# EasyEDA schematic SCH_智能鱼缸_2023-12-28.json
TITLE: Sheet_1; REV: 1.0; Date: 2023-05-17; Sheet: 1/1; Drawn By: CQT-LINFENG; Company: Your Company
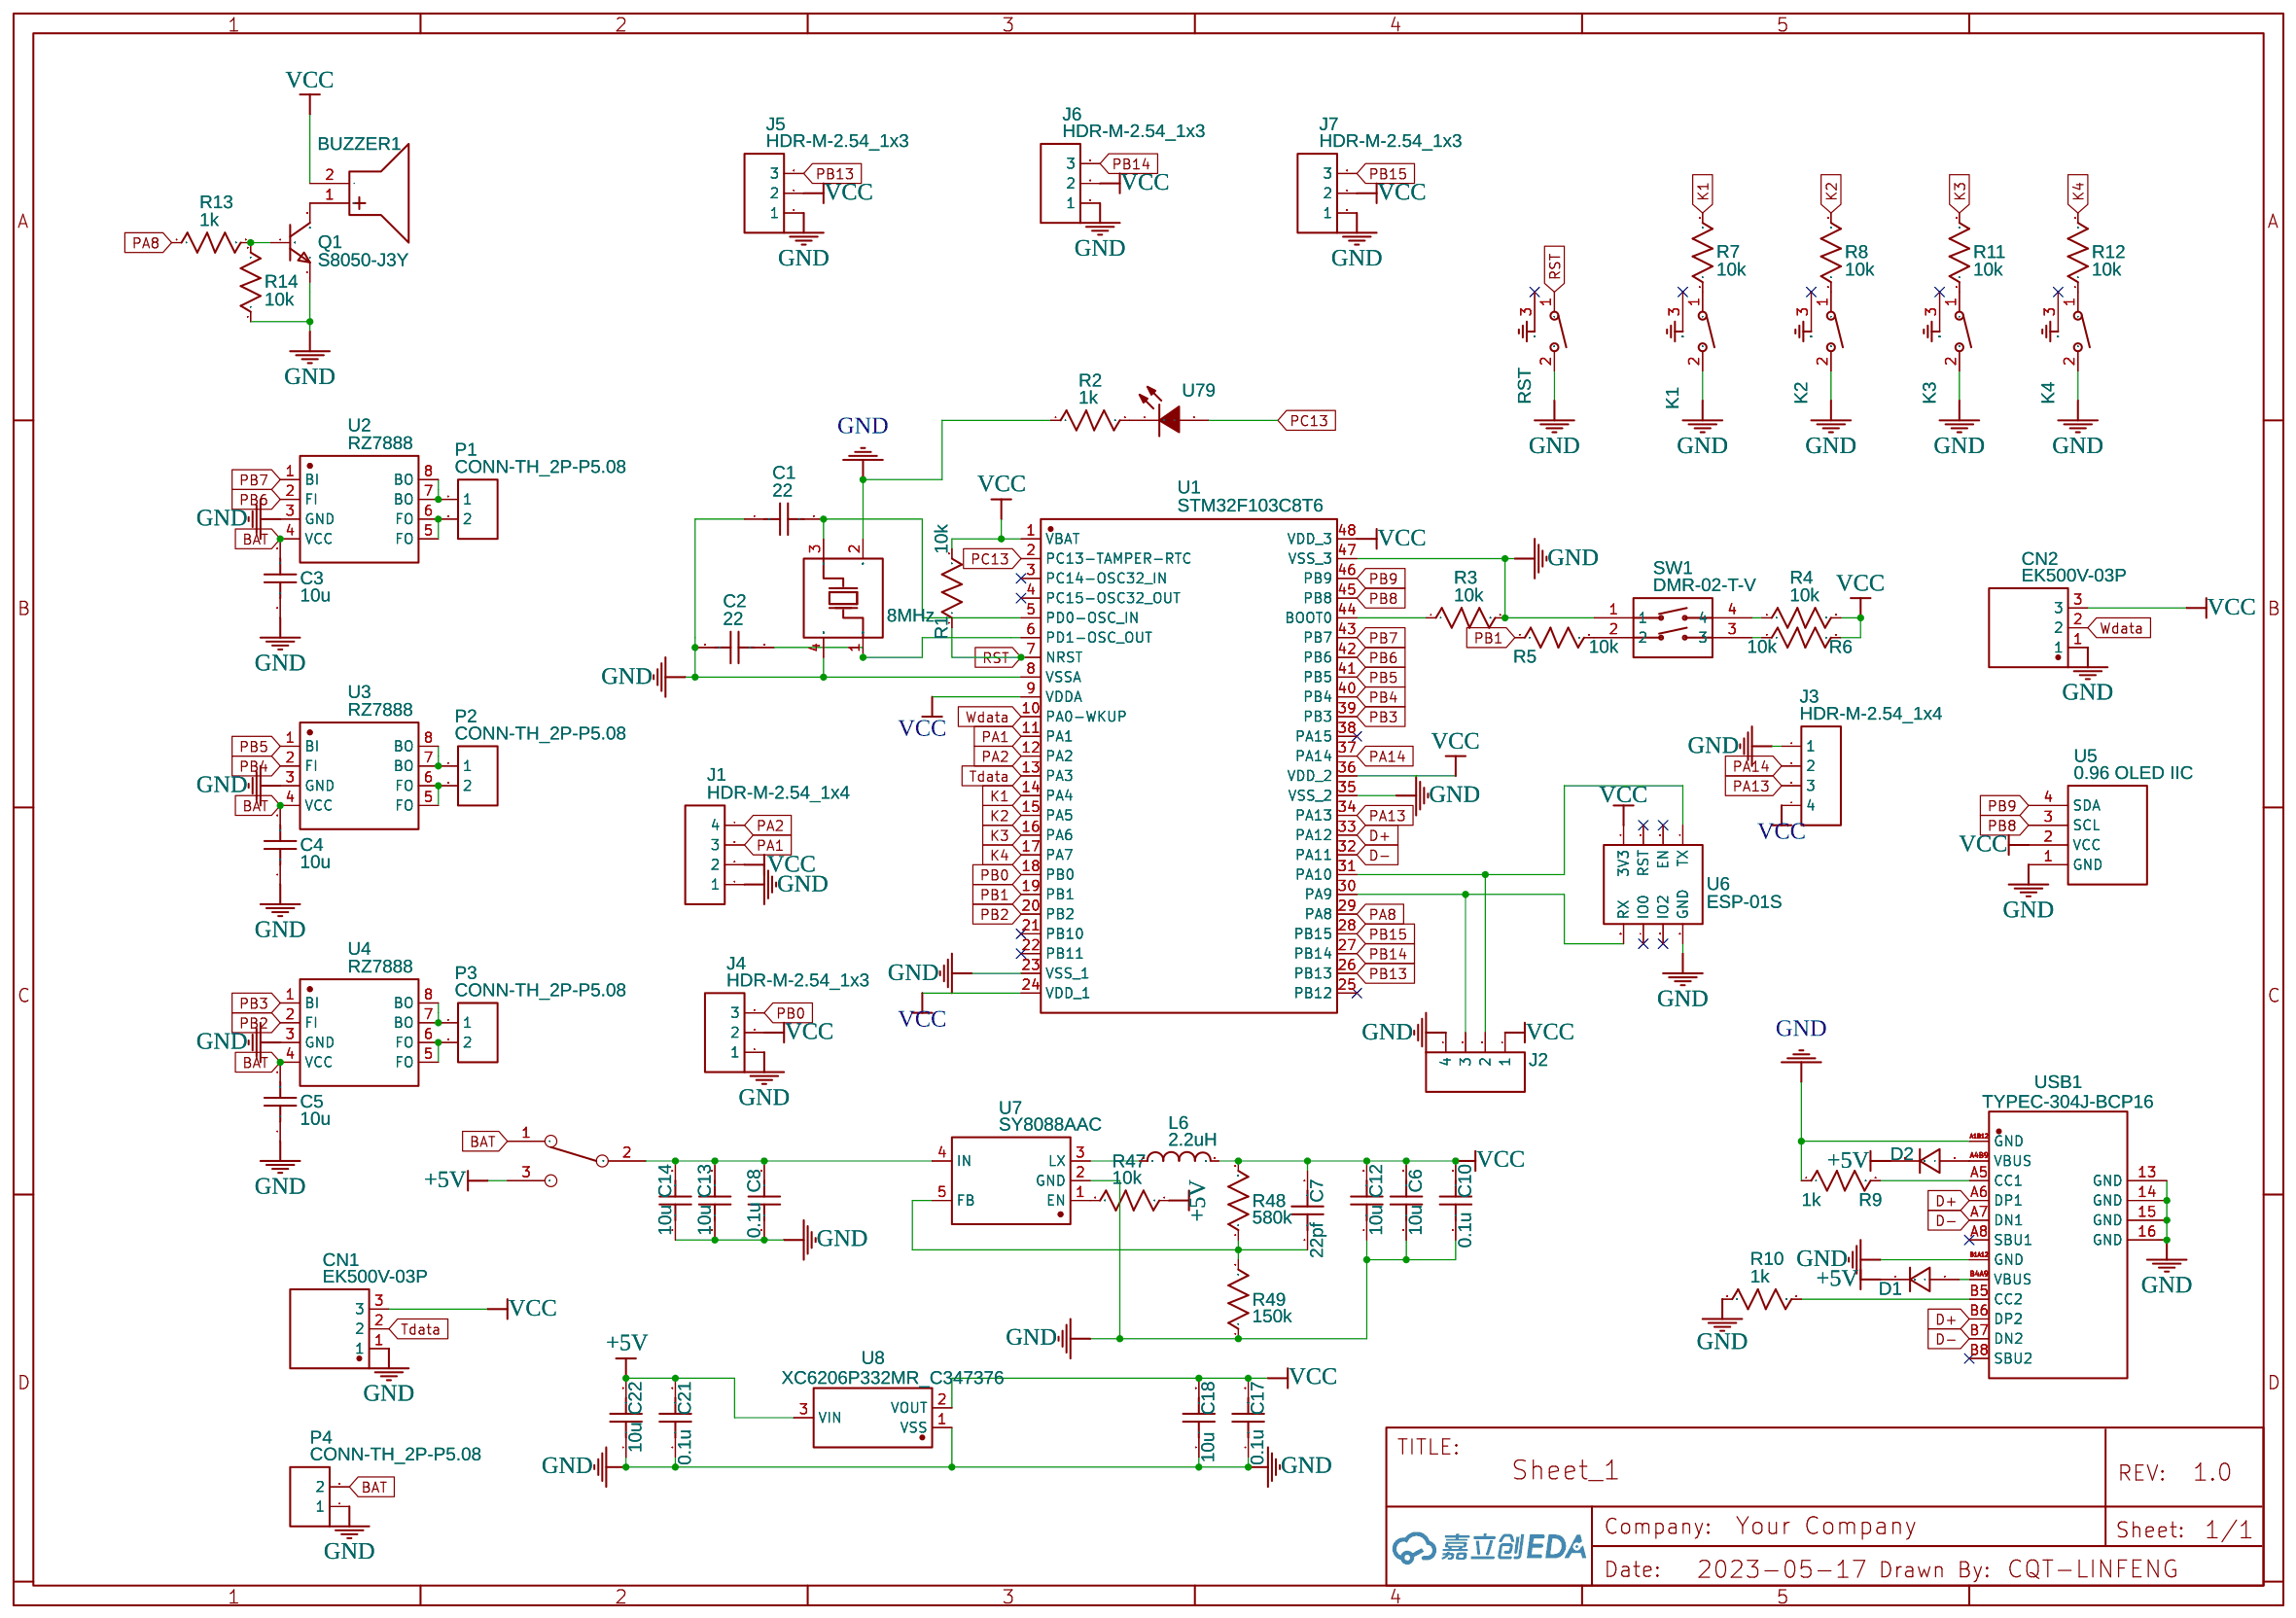
[diagram p0: schematic sheet]

## Parts
BUZZER1  有源蜂鸣器直径9*5.5MM3V  [BUZ-TH_BD9.0-P5.00-D0.6-L-FD]
C1  22  [C0402]
C2  22  [C0402]
C3  10u  [C0402]
C4  10u  [C0402]
C5  10u  [C0402]
C6  10u  [C0402]
C7  22pf  [C0402]
C8  0.1u  [C0402]
C10  0.1u  [C0402]
C12  10u  [C0402]
C13  10u  [C0402]
C14  10u  [C0402]
C17  0.1u  [C0402]
C18  10u  [C0402]
C21  0.1u  [C0402]
C22  10u  [C0402]
CN1  EK500V-03P  [CONN-TH_EK500V-03P]
CN2  EK500V-03P  [CONN-TH_EK500V-03P]
D1  1N4148WSG  [SOD-323_L1.8-W1.3-LS2.5-RD]
D2  1N4148WSG  [SOD-323_L1.8-W1.3-LS2.5-RD]
ENABLE1  SS-12D00-G4  [SS-12D00-G4]
J1  HDR-M-2.54_1x4  [HDR-M-2.54_1X4]
J2  HDR-M-2.54_1x4  [HDR-M-2.54_1X4]
J3  HDR-M-2.54_1x4  [HDR-M-2.54_1X4]
J4  HDR-M-2.54_1x3  [HDR-M-2.54_1X3]
J5  HDR-M-2.54_1x3  [HDR-M-2.54_1X3]
J6  HDR-M-2.54_1x3  [HDR-M-2.54_1X3]
J7  HDR-M-2.54_1x3  [HDR-M-2.54_1X3]
K1  侧按键  [侧按键]
K2  侧按键  [侧按键]
K3  侧按键  [侧按键]
K4  侧按键  [侧按键]
L6  2.2uH  [IND-SMD_L3.5-W3.0]
P1  CONN-TH_2P-P5.08  [CONN-TH_2P-P5.08]
P2  CONN-TH_2P-P5.08  [CONN-TH_2P-P5.08]
P3  CONN-TH_2P-P5.08  [CONN-TH_2P-P5.08]
P4  CONN-TH_2P-P5.08  [CONN-TH_2P-P5.08]
Q1  S8050-J3Y  [SOT-23-3_L3.0-W1.7-P0.95-LS2.9-BR]
R1  10k  [R0402]
R2  1k  [R0402]
R3  10k  [R0402]
R4  10k  [R0402]
R5  10k  [R0402]
R6  10k  [R0402]
R7  10k  [R0402]
R8  10k  [R0402]
R9  1k  [R0402]
R10  1k  [R0402]
R11  10k  [R0402]
R12  10k  [R0402]
R13  1k  [R0402]
R14  10k  [R0402]
R47  10k  [R0402]
R48  580k  [R0402]
R49  150k  [R0402]
RST  侧按键  [侧按键]
SW1  DMR-02-T-V  [SW-SMD_DMR-02-T-V]
U1  STM32F103C8T6  [LQFP-48_L7.0-W7.0-P0.50-LS9.0-BL]
U2  RZ7888  [SOP-8_L4.9-W3.9-P1.27-LS6.0-BL]
U3  RZ7888  [SOP-8_L4.9-W3.9-P1.27-LS6.0-BL]
U4  RZ7888  [SOP-8_L4.9-W3.9-P1.27-LS6.0-BL]
U5  0.96 OLED IIC  [OLED-TH_OLED0.96-IIC]
U6  ESP-01S  [ESP01S-(ESP01)]
U7  SY8088AAC  [SOT-23-5_L3.0-W1.7-P0.95-LS2.8-BR]
U8  XC6206P332MR_C347376  [SOT-23-3_L3.0-W1.7-P0.95-LS2.9-BR]
U79  GBG-C281TBKT  [LED0402-RD]
USB1  TYPEC-304J-BCP16  [USB-C-SMD_TYPEC-304J-BCP16]
X1  8MHz  [CRYSTAL-SMD_4P-L3.2-W2.5-BL]

## Library data of the parts
BUZZER1 = 有源蜂鸣器直径9*5.5MM3V: Supplier: LCSC; Supplier Part: C9900012728; Manufacturer: null; Manufacturer Part: 有源蜂鸣器直径9*5.5mm3V; Contributor: LCSC; JLCPCB Part Class: Extended Part
C1-C8 C10 C12-C14 C17 C18 C21 C22 = C_0402_US: Contributor: LCEDA_Lib
CN1 CN2 = EK500V-03P: Supplier: LCSC; Supplier Part: C182803; Manufacturer: dinkle(町洋); Contributor: LCSC; JLCPCB Part Class: Extended Part
D1 D2 = 1N4148WSG: Supplier: LCSC; Supplier Part: C380926; Manufacturer: 银河微电子; Contributor: LCSC; JLCPCB Part Class: Extended Part
ENABLE1 = SS-12D00-G4: Contributor: 1898stark
J1-J3 = HDR-M-2.54_1x4: Supplier Part: C124378; Supplier: LCSC; Contributor: LCEDA_Lib
J4-J7 = HDR-M-2.54_1x3: Supplier Part: C180248; Supplier: LCSC; Contributor: LCEDA_Lib
K1-K4 RST = 侧按键: Contributor: liyichuangeda
L6 = SMTDR32-2R2M: Supplier: LCSC; Supplier Part: C326182; Manufacturer: 3L COILS; Contributor: LCSC
P1-P4 = CONN-TH_2P-P5.08: Supplier: LCSC; Contributor: LCEDA_Lib
Q1 = S8050-J3Y: Supplier: LCSC; Supplier Part: C364312; Manufacturer: MDD; Contributor: LCSC; JLCPCB Part Class: Extended Part
R1-R14 R47-R49 = R_0402_US: Contributor: LCEDA_Lib
SW1 = DMR-02-T-V: Supplier: LCSC; Manufacturer: 圜达; Contributor: LCSC; Supplier Part: C139554; JLCPCB Part Class: Extended Part
U1 = STM32F103C8T6: Supplier: LCSC; Manufacturer: ST(意法半导体); Supplier Part: C8734; JLCPCB Part Class: Basic Part
U2-U4 = RZ7888: Supplier: LCSC; Manufacturer: RZ; Supplier Part: C94177; JLCPCB Part Class: Extended Part
U5 = 0.96 OLED IIC: Contributor: 0errors0warning
U6 = ESP-01S: Supplier: Add New Supplier; Contributor: zhangshiyu
U7 = SY8088AAC: Supplier: LCSC; Manufacturer: Silergy; Supplier Part: C79313; LCSC Assembly: Yes; SMT Type: Extend; Contributor: Sanksu
U8 = XC6206P332MR_C347376: Supplier: LCSC; Supplier Part: C347376; Manufacturer: UMW(广东友台半导体); Manufacturer Part: XC6206P332MR; Contributor: LCSC; JLCPCB Part Class: Extended Part
U79 = GBG-C281TBKT: Supplier: LCSC; Supplier Part: C2892152; Manufacturer: GBG; link: https://atta.szlcsc.comnull; Contributor: lcsc
USB1 = TYPEC-304J-BCP16: Supplier: LCSC; Supplier Part: C2835315; Manufacturer: XUNPU(讯普); Contributor: LCSC; JLCPCB Part Class: Extended Part
X1 = X1E0000210375000G: Supplier: LCSC; Manufacturer: EPSON(爱普生); Manufacturer Part: X1E000021037500; Contributor: LCSC; Supplier Part: C89379; JLCPCB Part Class: Extended Part

## Nets
+5V: C21.2 C22.2 D1.1(C) D2.1(C) ENABLE1.3 R47.1 U8.3(VIN)
GND: C1.1 C2.1 C3.1 C4.1 C5.1 C6.1 C8.1 C10.1 C12.1 C13.1 C14.1 C17.1 C18.1 C21.1 C22.1 CN1.1 CN2.1 J1.1 J2.4 J3.1 J4.1 J5.1 J6.1 J7.1 K1.2 K2.2 K3.2 K4.2 P4.1 Q1.2(E) R2.1 R3.2 R9.1 R10.1 R14.1 R49.1 RST.2 SW1.1 U1.8(VSSA) U1.23(VSS_1) U1.35(VSS_2) U1.47(VSS_3) U2.3(GND) U3.3(GND) U4.3(GND) U5.1(GND) U6.5(GND) U7.2(GND) U8.1(VSS) USB1.13(GND) USB1.14(GND) USB1.15(GND) USB1.16(GND) USB1.A1B12(GND) USB1.B1A12(GND) X1.2(GND) X1.4(GND)
VCC: BUZZER1.2(-) C6.2 C7.2 C10.2 C12.2 C17.2 C18.2 CN1.3 CN2.3 J1.2 J2.1 J3.4 J4.2 J5.2 J6.2 J7.2 L6.2 R1.2 R4.2 R6.2 R48.2 U1.1(VBAT) U1.9(VDDA) U1.24(VDD_1) U1.36(VDD_2) U1.48(VDD_3) U5.2(VCC) U6.1(3V3) U8.2(VOUT)
BAT: C3.2 C4.2 C5.2 ENABLE1.1 P4.2 U2.4(VCC) U3.4(VCC) U4.4(VCC)
D+: U1.33(PA12) USB1.A6(DP1) USB1.B6(DP2)
D-: U1.32(PA11) USB1.A7(DN1) USB1.B7(DN2)
K1: R7.2 U1.14(PA4)
K2: R8.2 U1.15(PA5)
K3: R11.2 U1.16(PA6)
K4: R12.2 U1.17(PA7)
PA1: J1.3 U1.11(PA1)
PA2: J1.4 U1.12(PA2)
PA8: R13.1 U1.29(PA8)
PA13: J3.3 U1.34(PA13)
PA14: J3.2 U1.37(PA14)
PB0: J4.3 U1.18(PB0)
PB1: R5.1 U1.19(PB1)
PB2: U1.20(PB2) U4.2(FI)
PB3: U1.39(PB3) U4.1(BI)
PB4: U1.40(PB4) U3.2(FI)
PB5: U1.41(PB5) U3.1(BI)
PB6: U1.42(PB6) U2.2(FI)
PB7: U1.43(PB7) U2.1(BI)
PB8: U1.45(PB8) U5.3(SCL)
PB9: U1.46(PB9) U5.4(SDA)
PB13: J5.3 U1.26(PB13)
PB14: J6.3 U1.27(PB14)
PB15: J7.3 U1.28(PB15)
PC13: U1.2(PC13-TAMPER-RTC) U79.2(A)
RST: R1.1 RST.1 U1.7(NRST)
Tdata: CN1.2 U1.13(PA3)
Wdata: CN2.2 U1.10(PA0-WKUP)
Net-(BUZZER1-1): BUZZER1.1(+) Q1.3(C)
Net-(C1-2): C1.2 U1.5(PD0-OSC_IN) X1.3(OSC2)
Net-(C2-2): C2.2 U1.6(PD1-OSC_OUT) X1.1(OSC1)
Net-(C7-1): C7.1 R48.1 R49.2 U7.5(FB)
Net-(C8-2): C8.2 C13.2 C14.2 ENABLE1.2 U7.4(IN)
Net-(D1-2): D1.2(A) USB1.B4A9(VBUS)
Net-(D2-2): D2.2(A) USB1.A4B9(VBUS)
Net-(J2-2): J2.2 U1.31(PA10) U6.4(TX)
Net-(J2-3): J2.3 U1.30(PA9) U6.8(RX)
Net-(K1-1): K1.1 R7.1
Net-(K2-1): K2.1 R8.1
Net-(K3-1): K3.1 R11.1
Net-(K4-1): K4.1 R12.1
Net-(L6-1): L6.1 U7.3(LX)
Net-(P1-1): P1.1 U2.7(BO) U2.8(BO)
Net-(P1-2): P1.2 U2.5(FO) U2.6(FO)
Net-(P2-1): P2.1 U3.7(BO) U3.8(BO)
Net-(P2-2): P2.2 U3.5(FO) U3.6(FO)
Net-(P3-1): P3.1 U4.7(BO) U4.8(BO)
Net-(P3-2): P3.2 U4.5(FO) U4.6(FO)
Net-(Q1-1): Q1.1(B) R13.2 R14.2
Net-(R2-2): R2.2 U79.1(C)
Net-(R3-1): R3.1 U1.44(BOOT0)
Net-(R4-1): R4.1 SW1.4
Net-(R5-2): R5.2 SW1.2
Net-(R6-1): R6.1 SW1.3
Net-(R9-2): R9.2 USB1.A5(CC1)
Net-(R10-2): R10.2 USB1.B5(CC2)
Net-(R47-2): R47.2 U7.1(EN)

Not connected (* = marked no-connect by the designer): K1 3(GND)*; K2 3(GND)*; K3 3(GND)*; K4 3(GND)*; RST 3(GND)*; U1 3(PC14-OSC32_IN)* 4(PC15-OSC32_OUT)* 21(PB10)* 22(PB11)* 25(PB12)* 38(PA15)*; U6 2(RST)* 3(EN)* 6(IO2)* 7(IO0)*; USB1 A8(SBU1)* B8(SBU2)*
